# EAGLE schematic uLI-04 (EAGLE 9.2.2)
AUTHOR: M. Petrilak, J. Horacek; VERSION: 04 r3
Assembly variants: master, slave

## Sheet 1 of 2
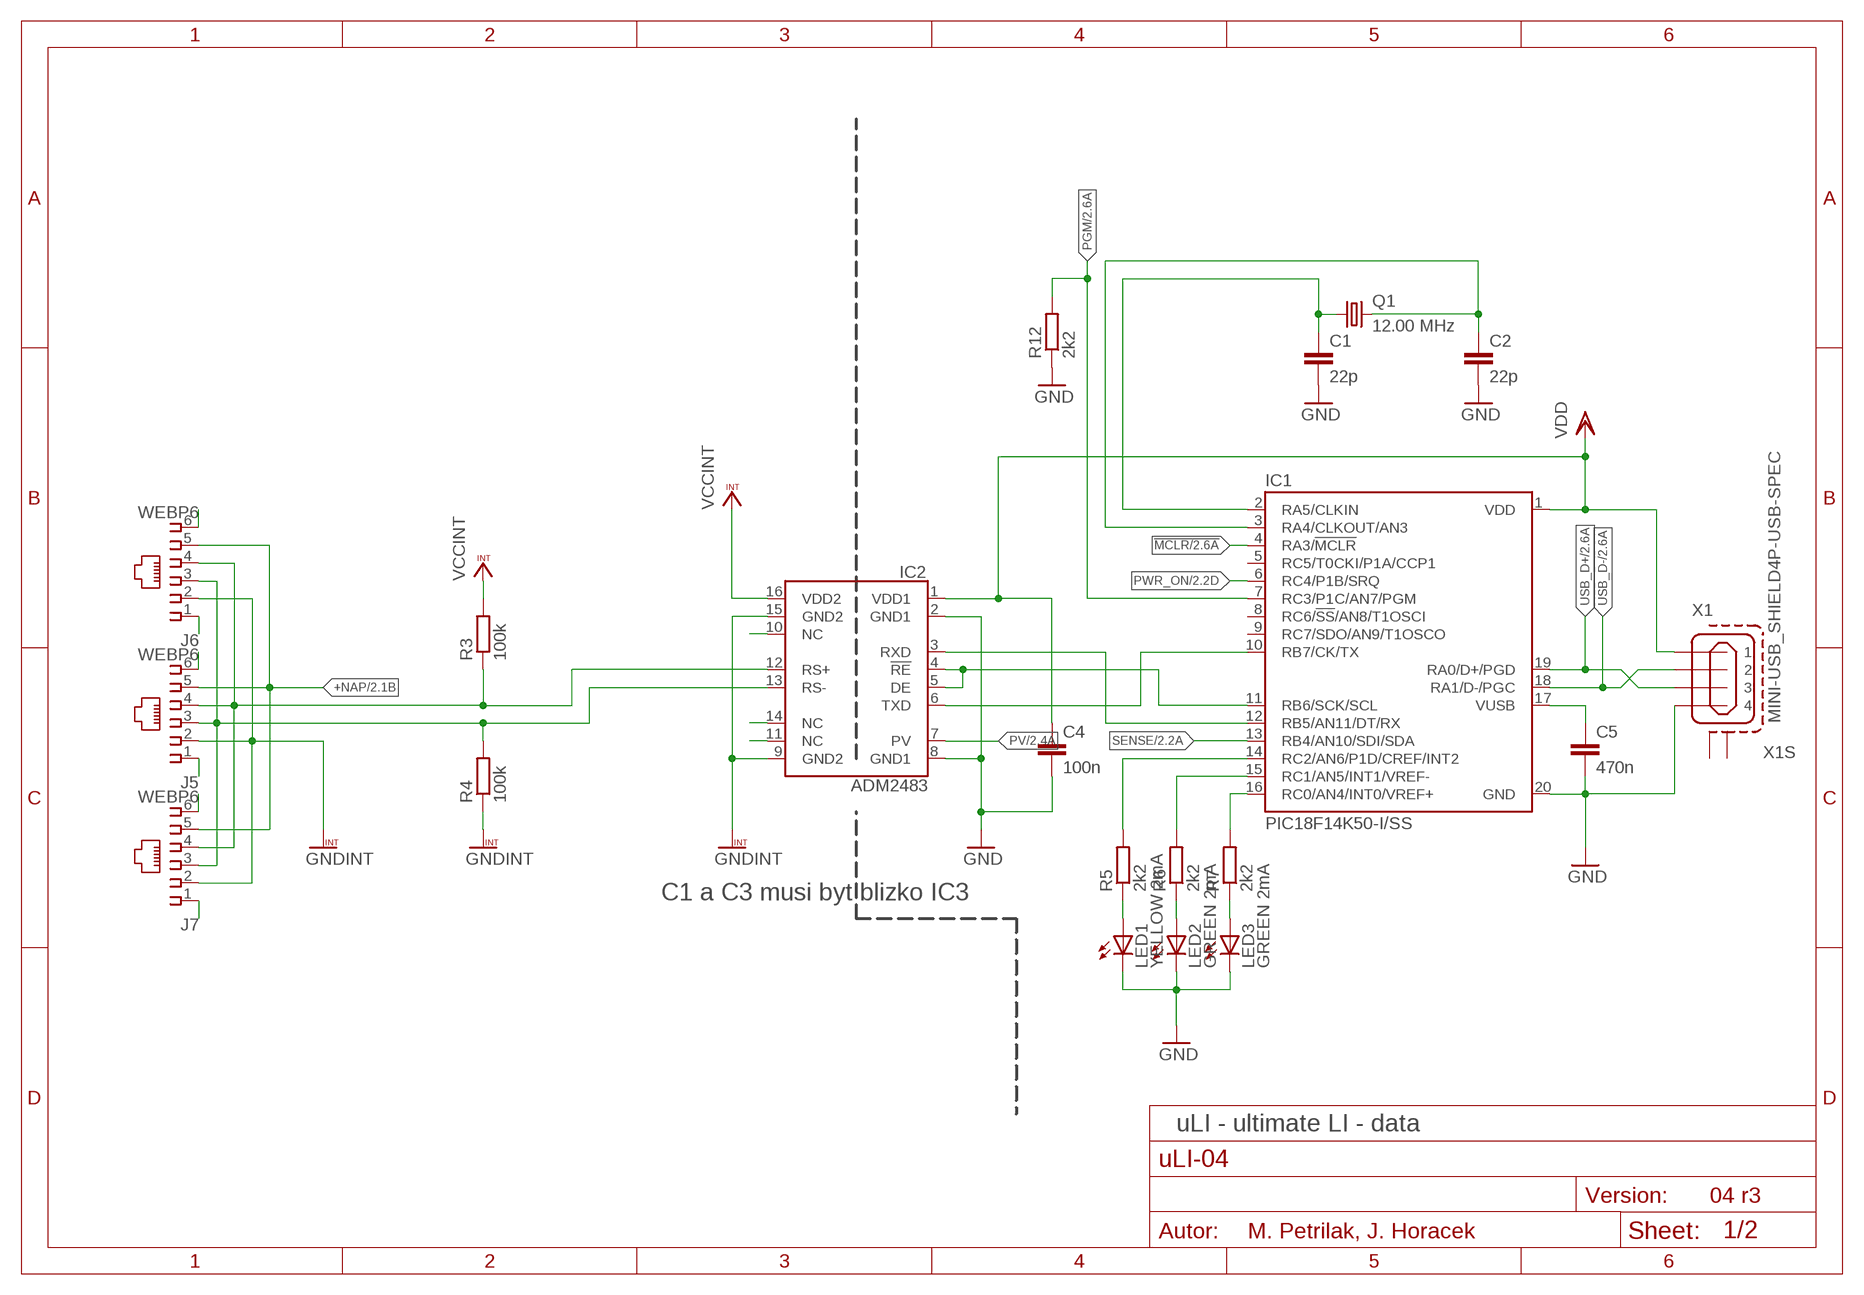
[diagram p0: schematic, sheet 1]

### Parts
C1  22p  C-EUC0805  [C0805]
C2  22p  C-EUC0805  [C0805]
C4  100n  C-EUC1206  [C1206]
C5  470n  C-EUC1206  [C1206]
IC1  PIC18F14K50-I/SS  [SSOP20]
IC2  ADM2483  [SO-16W]
J5  WEBP6  WEBP6-6_SPEC2  [WEBP6-6_SPEC2]  (not fitted in variant slave)
J6  WEBP6  WEBP6-6_SPEC2  [WEBP6-6_SPEC2]  (not fitted in variant slave)
J7  WEBP6  WEBP6-6_SPEC2  [WEBP6-6_SPEC2]  (not fitted in variant master)
LED1  YELLOW 2mA  LED3MM  [LED3MM]
LED2  GREEN 2mA  LED3MM  [LED3MM]
LED3  GREEN 2mA  LED3MM  [LED3MM]
Q1  12.00 MHz  XTAL  [HC49U70]
R3  100k  R-EU_R1206  [R1206]
R4  100k  R-EU_R1206  [R1206]
R5  2k2  R-EU_R1206  [R1206]
R6  2k2  R-EU_R1206  [R1206]
R7  2k2  R-EU_R1206  [R1206]
R12  2k2  R-EU_R1206  [R1206]
X1  MINI-USB_SHIELD4P-USB-SPEC  [85-32004-10X-SPEC]

### Nets
!MCLR: IC1.4(RA3/!MCLR!) ; also sheet 2
+NAP [BUS]: J5.5 J6.5 J7.5 ; also sheet 2
BUS_A [BUS]: IC2.12(RS+) J5.4 J6.4 J7.4 R3.1
BUS_B [BUS]: IC2.13(RS-) J5.3 J6.3 J7.3 R4.2
GND: C1.2 C2.2 C4.2 C5.2 IC1.20(GND) IC2.2(GND1) IC2.8(GND1) LED1.K(C) LED2.K(C) LED3.K(C) R12.1 X1.4 ; also sheet 2
GNDINT [BUS]: IC2.9(GND2) IC2.15(GND2) J5.2 J6.2 J7.2 R4.1 ; also sheet 2
LED1: IC1.14(RC2/AN6/P1D/CREF/INT2) R5.2
LED1_R: LED1.A R5.1
LED2: IC1.15(RC1/AN5/INT1/VREF-) R6.2
LED2_R: LED2.A R6.1
LED3: IC1.16(RC0/AN4/INT0/VREF+) R7.2
LED3_R: LED3.A R7.1
N$2 [BUS]: IC2.11(NC)
N$3 [BUS]: IC2.10(NC)
N$5: IC1.12(RB5/AN11/DT/RX) IC2.3(RXD)
N$8 [BUS]: J6.6
N$11 [BUS]: J6.1
N$12 [BUS]: J5.6
N$13 [BUS]: J5.1
N$14 [BUS]: J7.6
N$15 [BUS]: J7.1
NC2 [BUS]: IC2.14(NC)
PGM: IC1.7(RC3/P1C/AN7/PGM) R12.2 ; also sheet 2
PROC_RX: IC1.10(RB7/CK/TX) IC2.6(TXD)
PROC_TE: IC1.11(RB6/SCK/SCL) IC2.4(!RE) IC2.5(DE)
PV: IC2.7(PV) ; also sheet 2
PWR_ON: IC1.6(RC4/P1B/SRQ) ; also sheet 2
SENSE: IC1.13(RB4/AN10/SDI/SDA) ; also sheet 2
USB_D+: IC1.19(RA0/D+/PGD) X1.3 ; also sheet 2
USB_D-: IC1.18(RA1/D-/PGC) X1.2 ; also sheet 2
VBUS: C5.1 IC1.17(VUSB)
VCCINT [BUS]: IC2.16(VDD2) R3.2 ; also sheet 2
VDD: C4.1 IC1.1(VDD) IC2.1(VDD1) X1.1 ; also sheet 2
XTAL1: C1.1 IC1.2(RA5/CLKIN) Q1.1
XTAL2: C2.1 IC1.3(RA4/CLKOUT/AN3) Q1.2
Unconnected: IC1.5(RC5/T0CKI/P1A/CCP1) IC1.8(RC6/!SS!/AN8/T1OSCI) IC1.9(RC7/SDO/AN9/T1OSCO) X1.M1(S1) X1.M2(S2)

### Notes on the sheet
- C1 a C3 musi byt blizko IC3
- uLI - ultimate LI - data

## Sheet 2 of 2
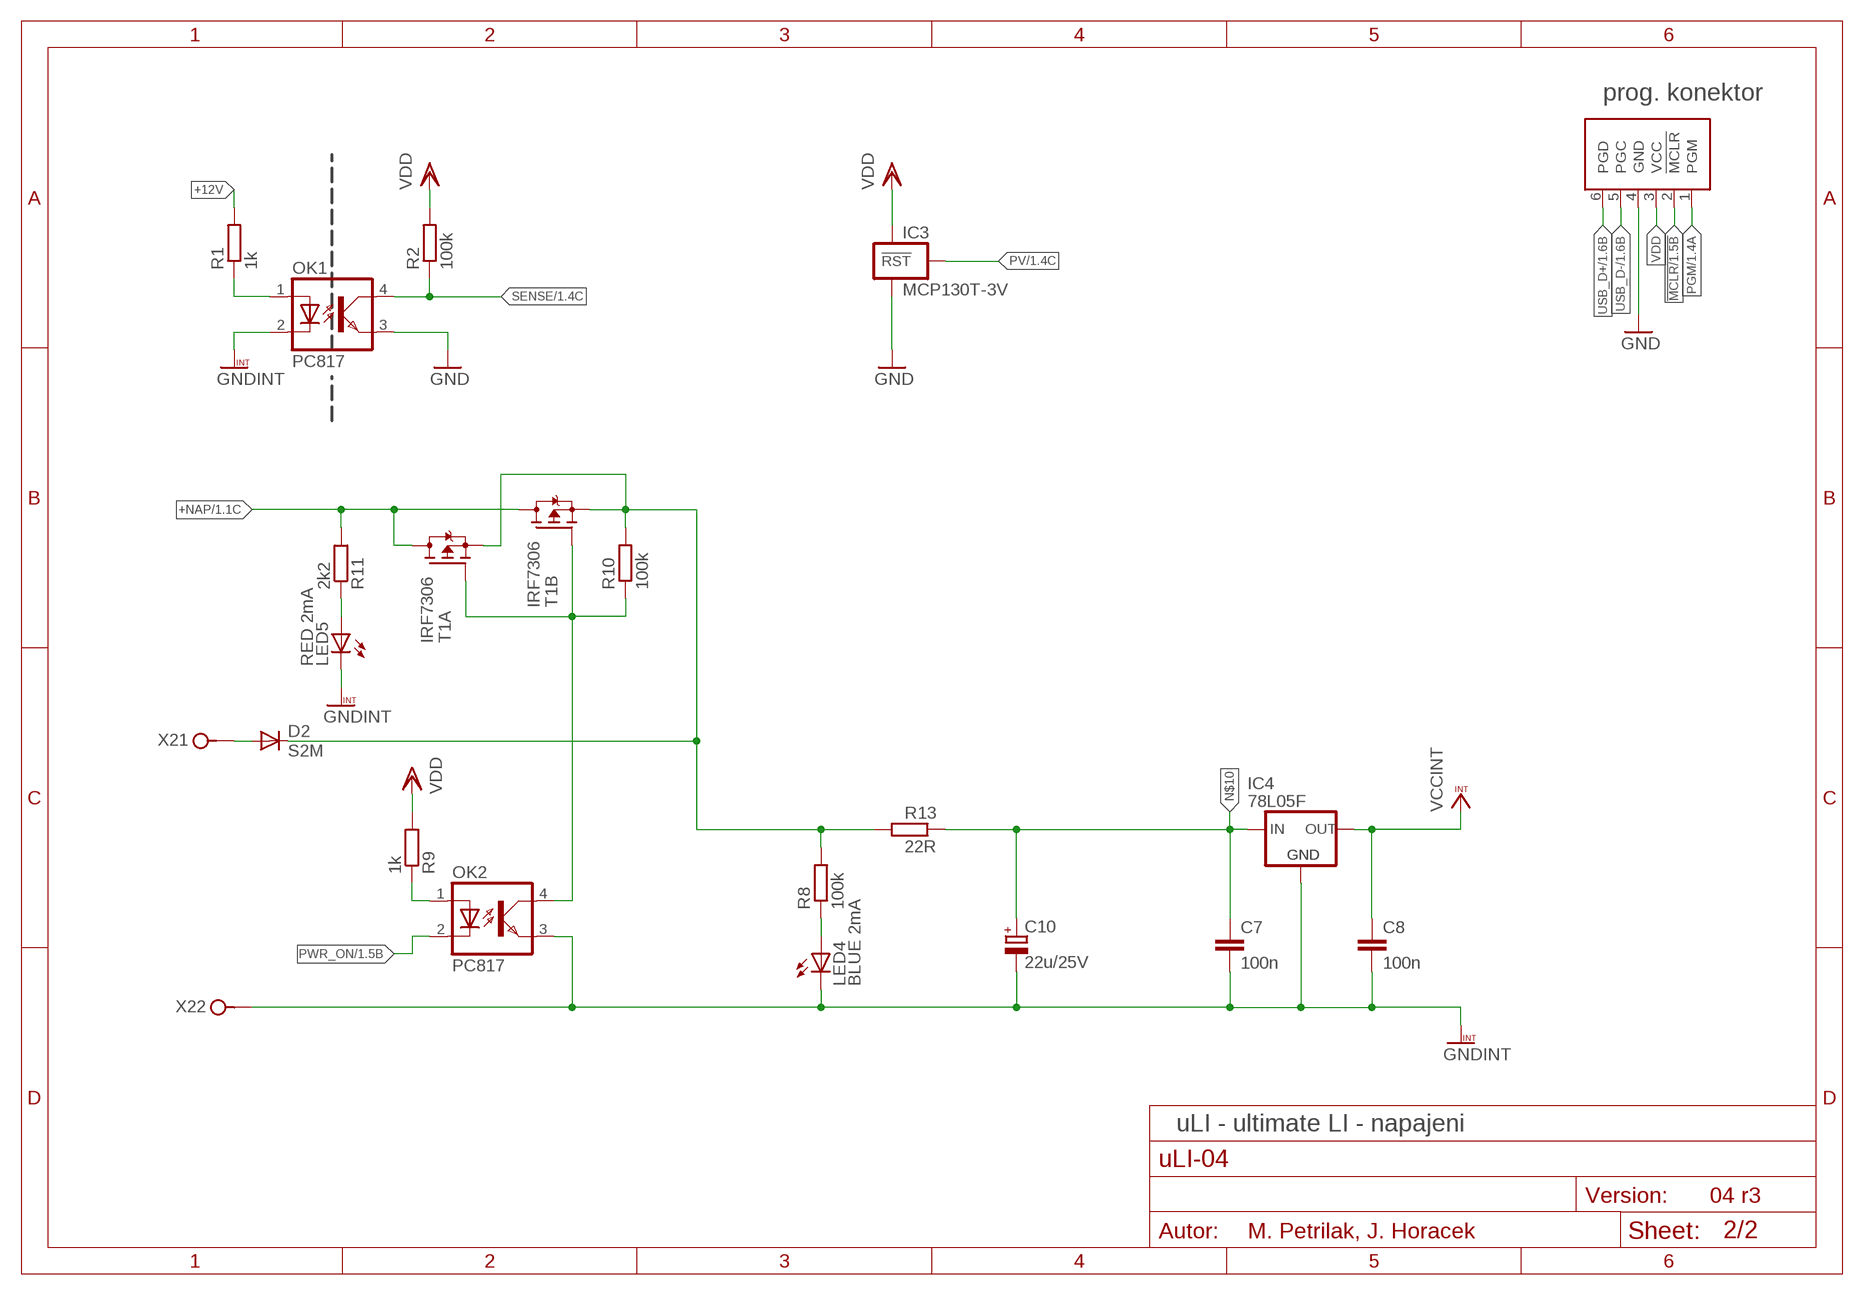
[diagram p1: schematic, sheet 2]

### Parts
C7  100n  C-EUC1206  [C1206]
C8  100n  C-EUC1206  [C1206]
C10  22u/25V  CPOL-EUE2-5  [E2-5]
D2  S2M  [SMB]  (not fitted in variant slave)
IC3  MCP130T-3V  MCP130T  [SOT23]
IC4  78L05F  [SOT89]
J1  PICPROG2-V  [6410-06-PICPROG]
LED4  BLUE 2mA  LED3MM  [LED3MM]  (not fitted in variant slave)
LED5  RED 2mA  LED3MM  [LED3MM]
OK1  PC817  [DIL04]  (not fitted in variant slave)
OK2  PC817  [DIL04]  (not fitted in variant slave)
R1  1k  R-EU_R1206  [R1206]  (not fitted in variant slave)
R2  100k  R-EU_R1206  [R1206]  (not fitted in variant slave)
R8  100k  R-EU_R1206  [R1206]  (not fitted in variant slave)
R9  1k  R-EU_R1206  [R1206]  (not fitted in variant slave)
R10  100k  R-EU_R1206  [R1206]
R11  2k2  R-EU_R1206  [R1206]
R13  22R  R-EU_R1206  [R1206]  (variant master: 0R)
T1  IRF7306  [SO08-IRF]
X2  ARK1550/2_S  [ARK1550/2_SPEC]  (not fitted in variant slave)

### Nets
!MCLR: J1.2(!MCLR) ; also sheet 1
+12V [BUS]: D2.C R1.2 R8.2 R10.2 R13.2 T1.1(A:S) T1.3(B:S)
+NAP [BUS]: R11.2 T1.5(B:D) T1.6(B:D) T1.7(A:D) T1.8(A:D) ; also sheet 1
+NAP2 [BUS]: D2.A X2.1
BUS_SENSE [BUS]: OK1.1(A) R1.1
GND: IC3.3(GND) J1.4(GND) OK1.3(EMIT) ; also sheet 1
GNDINT [BUS]: C7.2 C8.2 C10.- IC4.2(GND) IC4.2@1(GND) LED4.K(C) LED5.K(C) OK1.2(C) OK2.3(EMIT) X2.2 ; also sheet 1
N$1 [BUS]: LED4.A R8.1
N$4 [BUS]: LED5.A R11.1
N$6 [BUS]: OK2.4(COL) R10.1 T1.2(A:G) T1.4(B:G)
N$7: OK2.1(A) R9.1
N$10 [BUS]: C7.1 C10.+ IC4.3(VI) R13.1
PGM: J1.1(PGM) ; also sheet 1
PV: IC3.1(!RST) ; also sheet 1
PWR_ON: OK2.2(C) ; also sheet 1
SENSE: OK1.4(COL) R2.1 ; also sheet 1
USB_D+: J1.6(PGD) ; also sheet 1
USB_D-: J1.5(PGC) ; also sheet 1
VCCINT [BUS]: C8.1 IC4.1(VO) ; also sheet 1
VDD: IC3.2(VCC) J1.3(VCC) R2.2 R9.2 ; also sheet 1

### Notes on the sheet
- prog. konektor
- uLI - ultimate LI - napajeni

## Library data of the parts
C1 C2 C4 C5 C7 C8 = rcl:C-EU: CAPACITOR, European symbol
C10 = rcl:CPOL-EU: POLARIZED CAPACITOR, European symbol
D2 = diode:S2M
IC1 = microchip:PIC18*K50: PIC with USB
IC2 = my:ADM2483
IC3 = my:MCP130T
IC4 = linear:78L*: POSITOIV-VOLTAGE REGULATORS Output up to 100 mA Source: http://focus.ti.com/lit/ds/symlink/ua78l05.pdf
J1 = con-molex:PICPROG2
J5-J7 = con-malina:WEBP6-6
LED1-LED5 = led:LED: LED OSRAM: - CHIPLED LG R971, LG N971, LY N971, LG Q971, LY Q971, LO R971, LY R971 LH N974, LH R974 LS Q976, LO Q976, LY Q976 LO Q996 - Hyper CHIPLED LW Q18S LB Q993, LB Q99A, LB R99A - SideLED LS A670, LO A670, LY A670, LG A670, LP A670 LB A673, LV A673, LT A673, LW A673 LH A674 LY A675 LS A676, LA A676, LO A676, LY A676, LW A676 LS A679, LY A679, LG A679 - Hyper Micro SIDELED® LS Y876, LA Y876, LO Y876, LY Y876 LT Y87S - SmartLED LW L88C, LW L88S LB L89C, LB L89S, LG L890 LS L89K, LO L89K, LY L89K LS L896, LA L896, LO L896, LY L896 - TOPLED LS T670, LO T670, LY T670, LG T670, LP T670 LSG T670, LSP T670, LSY T670, LOP T670, LYG T670 LG T671, LOG T671, LSG T671 LB T673, LV T673, LT T673, LW T673 LH T674 LS T676, LA T676, LO T676, LY T676, LB T676, LH T676, LSB T676, LW T676 LB T67C, LV T67C, LT T67C, LS T67K, LO T67K, LY T67K, LW E67C LS E67B, LA E67B, LO E67B, LY E67B, LB E67C, LV E67C, LT E67C LW T67C LS T679, LY T679, LG T679 LS T770, LO T770, LY T770, LG T770, LP T770 LB T773, LV T773, LT T773, LW T773 LH T774 LS E675, LA E675, LY E675, LS T675 LS T776, LA T776, LO T776, LY T776, LB T776 LHGB T686 LT T68C, LB T68C - Hyper Mini TOPLED® LB M676 - Mini TOPLED Santana® LG M470 LS M47K, LO M47K, LY M47K Source: http://www.osram.convergy.de LUXEON: - LUMILED® LXK2-PW12-R00, LXK2-PW12-S00, LXK2-PW14-U00, LXK2-PW14-V00 LXK2-PM12-R00, LXK2-PM12-S00, LXK2-PM14-U00 LXK2-PE12-Q00, LXK2-PE12-R00, LXK2-PE12-S00, LXK2-PE14-T00, LXK2-PE14-U00 LXK2-PB12-K00, LXK2-PB12-L00, LXK2-PB12-M00, LXK2-PB14-N00, LXK2-PB14-P00, LXK2-PB14-Q00 LXK2-PR12-L00, LXK2-PR12-M00, LXK2-PR14-Q00, LXK2-PR14-R00 LXK2-PD12-Q00, LXK2-PD12-R00, LXK2-PD12-S00 LXK2-PH12-R00, LXK2-PH12-S00 LXK2-PL12-P00, LXK2-PL12-Q00, LXK2-PL12-R00 Source: www.luxeon.com KINGBRIGHT: KA-3528ASYC Source: www.kingbright.com
OK1 OK2 = optocoupler:PC817: SHARP OPTO COUPLER
Q1 = crystal:XTAL
R1-R13 = rcl:R-EU_: RESISTOR, European symbol
T1 = transistor-fet:IRF7306
X1 = con-cypressindustries:MINI-USB_SHIELD4P-: MINI USB 4 Pol. Source: www.cypressindustries.com
X2 = con-malina:ARK1550/2

## Net classes
0 default: width 0.3 mm
1 BUS: clearance 3 mm to class 0